# Altium project AP1220_Control.PrjPcb
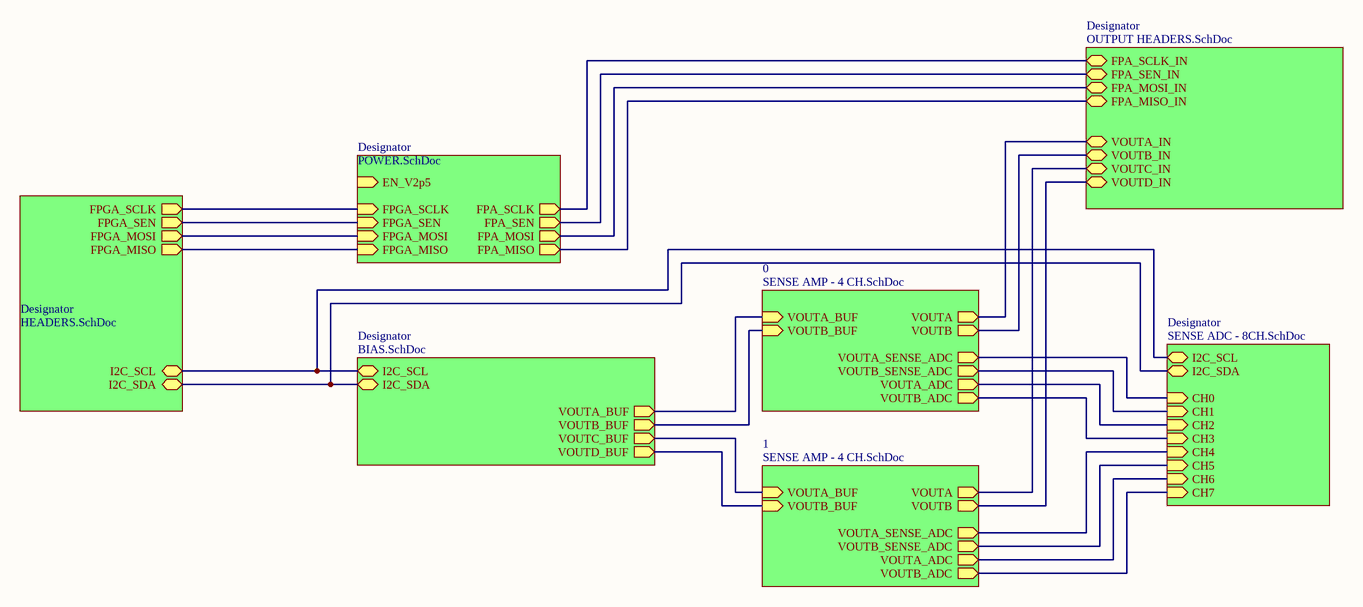
[diagram p0: AP1220_CONTROL.SchDoc]
7 sheets, 120 parts. Net scope: hierarchical (ports join the sheet entries above them; power ports are global).
Board file: AP1220_MachXO2_DB.PcbDoc
Sheets:
  AP1220_CONTROL.SchDoc
    Designator = HEADERS.SchDoc
    Designator = BIAS.SchDoc
    Designator = POWER.SchDoc
    0 = SENSE AMP - 4 CH.SchDoc
    1 = SENSE AMP - 4 CH.SchDoc
    Designator = SENSE ADC - 8CH.SchDoc
    Designator = OUTPUT HEADERS.SchDoc

## Sheet AP1220_CONTROL.SchDoc
size B; Organization: Altium Limited; Address1: L3, 12a Rodborough Rd; Address2: Frenchs Forest; Address3: NSW; Address4: Australia 2086

### Sub-sheets
0 = SENSE AMP - 4 CH.SchDoc: VOUTA_BUF (in), VOUTB_BUF (in), VOUTA (out), VOUTB (out), VOUTA_SENSE_ADC (out), VOUTB_SENSE_ADC (out), VOUTA_ADC (out), VOUTB_ADC (out)
1 = SENSE AMP - 4 CH.SchDoc: VOUTA_BUF (in), VOUTB_BUF (in), VOUTA (out), VOUTB (out), VOUTA_SENSE_ADC (out), VOUTB_SENSE_ADC (out), VOUTA_ADC (out), VOUTB_ADC (out)
Designator = HEADERS.SchDoc: I2C_SCL (bidir), I2C_SDA (bidir), FPGA_SEN (out), FPGA_MOSI (out), FPGA_MISO (out), FPGA_SCLK (out)
Designator = BIAS.SchDoc: I2C_SCL (bidir), I2C_SDA (bidir), VOUTA_BUF (out), VOUTD_BUF (out), VOUTB_BUF (out), VOUTC_BUF (out)
Designator = POWER.SchDoc: EN_V2p5 (in), FPGA_SEN (in), FPGA_MOSI (in), FPGA_MISO (in), FPGA_SCLK (in), FPA_SCLK (out), FPA_SEN (out), FPA_MOSI (out), FPA_MISO (out)
Designator = SENSE ADC - 8CH.SchDoc: I2C_SCL (bidir), I2C_SDA (bidir), CH0 (in), CH1 (in), CH2 (in), CH3 (in), CH4 (in), CH5 (in), CH6 (in), CH7 (in)
Designator = OUTPUT HEADERS.SchDoc: VOUTA_IN, VOUTB_IN, VOUTC_IN, VOUTD_IN, FPA_SCLK_IN, FPA_SEN_IN, FPA_MOSI_IN, FPA_MISO_IN

### Nets
VoutA: sheet 0/VOUTA, sheet Designator/VOUTA_IN
VoutA: sheet 1/VOUTA, sheet Designator/VOUTC_IN  [a separate net that carries the same name]
VoutB: sheet 0/VOUTB, sheet Designator/VOUTB_IN
VoutB: sheet 1/VOUTB, sheet Designator/VOUTD_IN  [a separate net that carries the same name]
NetC23_0_2: sheet 0/VOUTA_SENSE_ADC, sheet Designator/CH0
NetC23_1_2: sheet 1/VOUTA_SENSE_ADC, sheet Designator/CH4
NetC24_0_2: sheet 0/VOUTB_SENSE_ADC, sheet Designator/CH1
NetC24_1_2: sheet 1/VOUTB_SENSE_ADC, sheet Designator/CH5
NetC25_0_2: sheet 0/VOUTA_ADC, sheet Designator/CH2
NetC25_1_2: sheet 1/VOUTA_ADC, sheet Designator/CH6
NetC26_0_2: sheet 0/VOUTB_ADC, sheet Designator/CH3
NetC26_1_2: sheet 1/VOUTB_ADC, sheet Designator/CH7
NetJ1_2: sheet Designator/FPA_SCLK, sheet Designator/FPA_SCLK_IN
NetJ1_4: sheet Designator/FPA_SEN, sheet Designator/FPA_SEN_IN
NetJ1_6: sheet Designator/FPA_MOSI, sheet Designator/FPA_MOSI_IN
NetJ1_8: sheet Designator/FPA_MISO, sheet Designator/FPA_MISO_IN
NetJ4B_6: sheet Designator/I2C_SCL, sheet Designator/I2C_SCL, sheet Designator/I2C_SCL
NetJ4B_8: sheet Designator/I2C_SDA, sheet Designator/I2C_SDA, sheet Designator/I2C_SDA
NetJ4B_10: sheet Designator/FPGA_SCLK, sheet Designator/FPGA_SCLK
NetJ4B_12: sheet Designator/FPGA_SEN, sheet Designator/FPGA_SEN
NetJ4B_16: sheet Designator/FPGA_MOSI, sheet Designator/FPGA_MOSI
NetJ4B_18: sheet Designator/FPGA_MISO, sheet Designator/FPGA_MISO
NetR13_2: sheet Designator/VOUTA_BUF, sheet 0/VOUTA_BUF
NetR14_1: sheet Designator/VOUTD_BUF, sheet 1/VOUTB_BUF
NetR18_1_2: sheet Designator/VOUTC_BUF, sheet 1/VOUTA_BUF
NetR20_0_2: sheet Designator/VOUTB_BUF, sheet 0/VOUTB_BUF

### Notes on the sheet
- Title
- Size:
- Date:
- B
- Number:
- Time:
- Revision:
- Sheet
- of
- File:

## Sheet HEADERS.SchDoc
size B; Organization: Altium Limited; Address1: L3, 12a Rodborough Rd; Address2: Frenchs Forest; Address3: NSW; Address4: Australia 2086
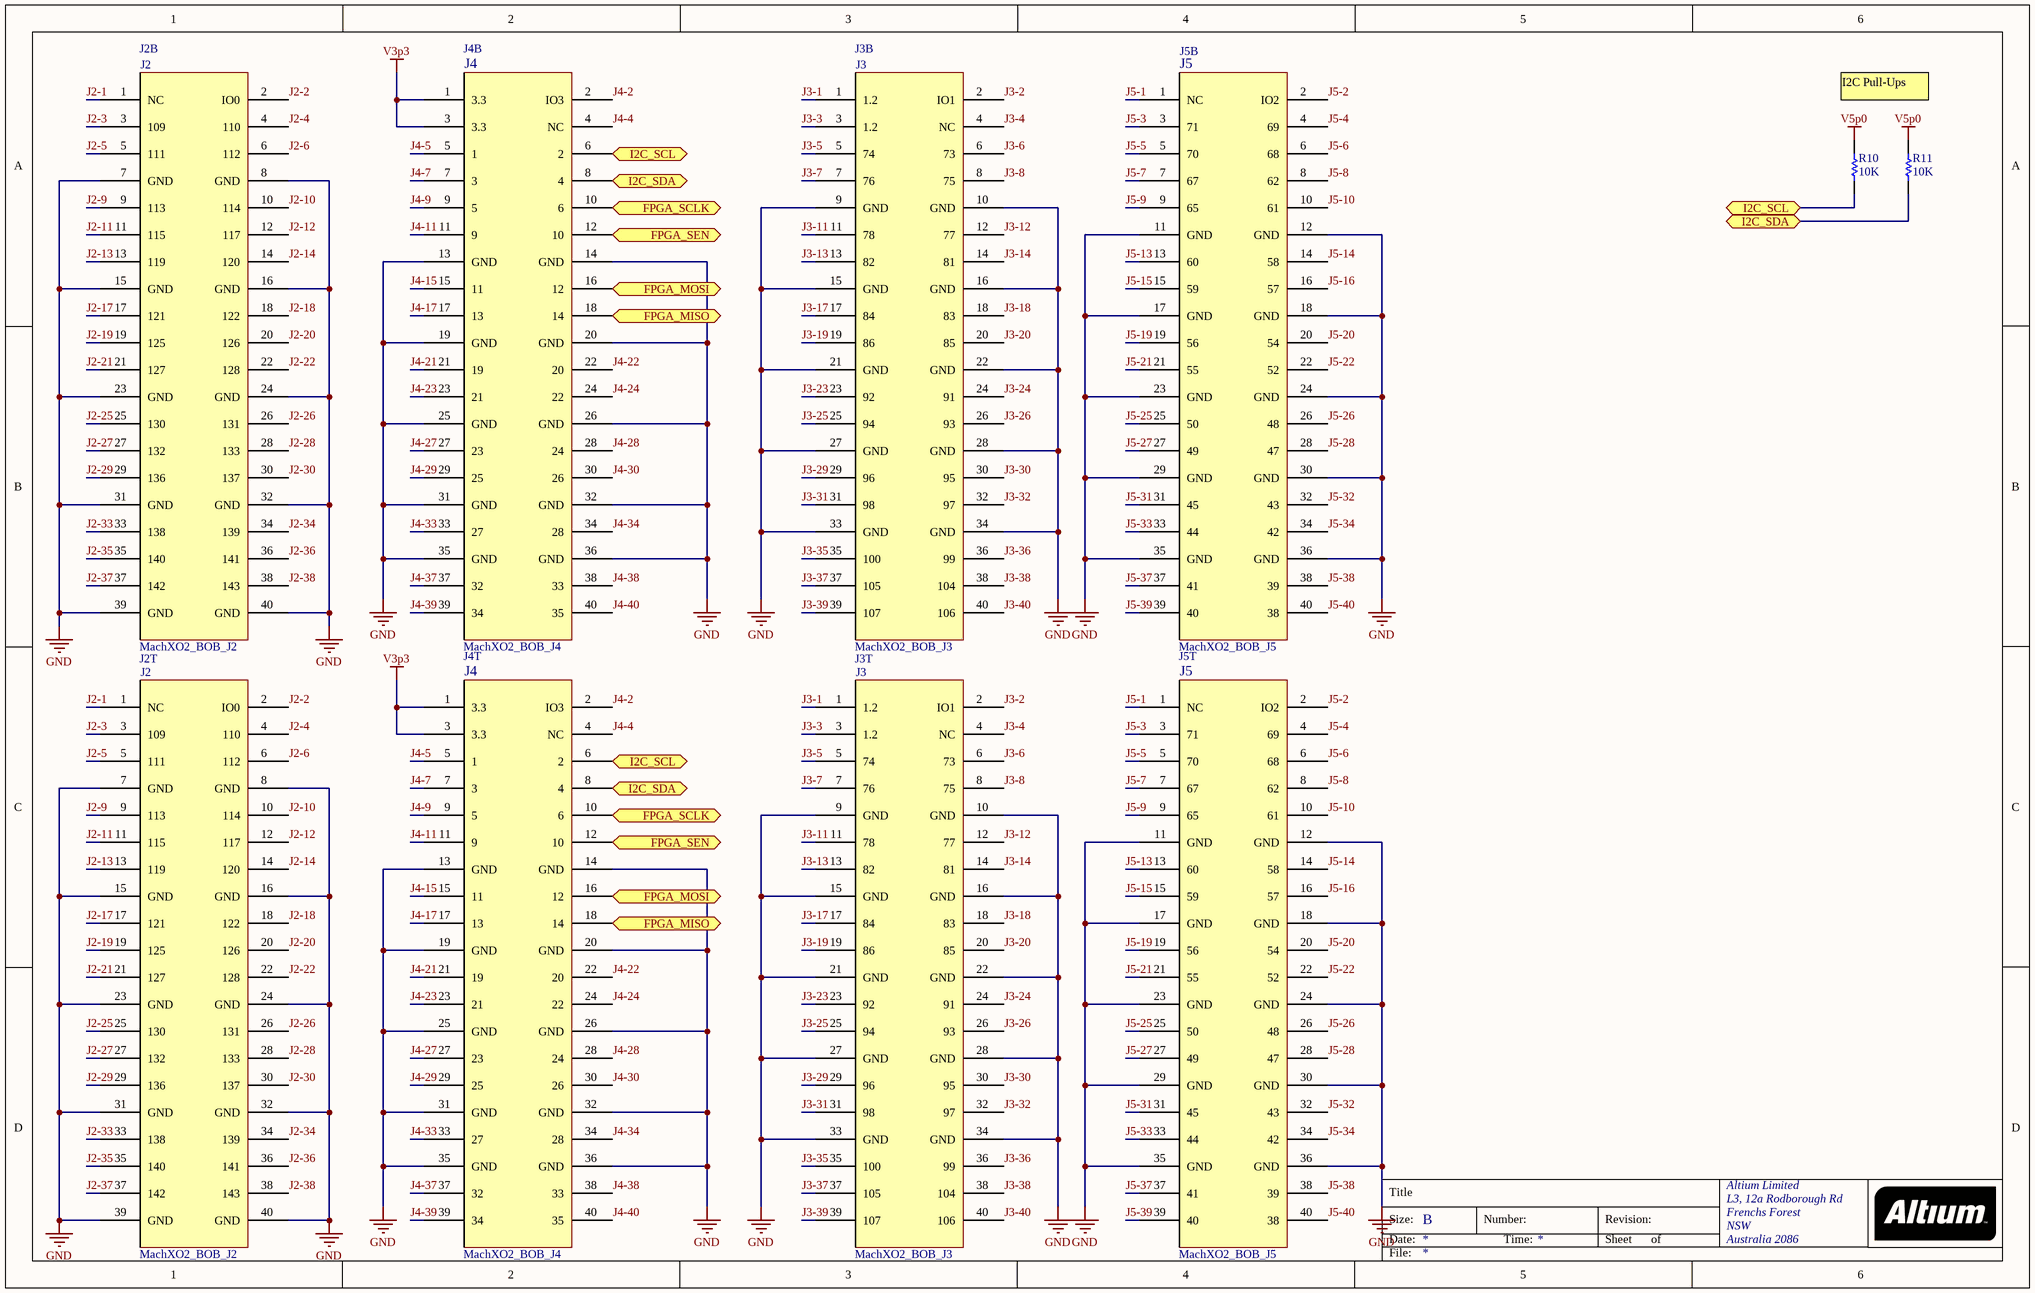
[diagram p1: HEADERS.SchDoc]

### Parts
J2B  MachXO2_BOB_J2  [RECEPTACLE_25.4MM_20x2_P1URC_SMT - duplicate]
J2T  MachXO2_BOB_J2  [HEADER_25.4MM_20x2_SMT_TOP]
J3B  MachXO2_BOB_J3  [RECEPTACLE_25.4MM_20x2_P1URC_SMT - duplicate]
J3T  MachXO2_BOB_J3  [HEADER_25.4MM_20x2_SMT_TOP]
J4B  MachXO2_BOB_J4  [RECEPTACLE_25.4MM_20x2_P1URC_SMT - duplicate]
J4T  MachXO2_BOB_J4  [HEADER_25.4MM_20x2_SMT_TOP]
J5B  MachXO2_BOB_J5  [RECEPTACLE_25.4MM_20x2_P1URC_SMT - duplicate]
J5T  MachXO2_BOB_J5  [HEADER_25.4MM_20x2_SMT_TOP]
R10  10K  [RES, 0603]
R11  10K  [RES, 0603]

### Ports
FPGA_MISO (bidir), FPGA_MOSI, FPGA_SCLK (bidir), FPGA_SEN (bidir), I2C_SCL (bidir), I2C_SDA (bidir)

### Nets
GND: J2B.7(GND) J2B.8(GND) J2B.15(GND) J2B.16(GND) J2B.23(GND) J2B.24(GND) J2B.31(GND) J2B.32(GND) J2B.39(GND) J2B.40(GND) J2T.7(GND) J2T.8(GND) J2T.15(GND) J2T.16(GND) J2T.23(GND) J2T.24(GND) J2T.31(GND) J2T.32(GND) J2T.39(GND) J2T.40(GND) J3B.9(GND) J3B.10(GND) J3B.15(GND) J3B.16(GND) J3B.21(GND) J3B.22(GND) J3B.27(GND) J3B.28(GND) J3B.33(GND) J3B.34(GND) J3T.9(GND) J3T.10(GND) J3T.15(GND) J3T.16(GND) J3T.21(GND) J3T.22(GND) J3T.27(GND) J3T.28(GND) J3T.33(GND) J3T.34(GND) J4B.13(GND) J4B.14(GND) J4B.19(GND) J4B.20(GND) J4B.25(GND) J4B.26(GND) J4B.31(GND) J4B.32(GND) J4B.35(GND) J4B.36(GND) J4T.13(GND) J4T.14(GND) J4T.19(GND) J4T.20(GND) J4T.25(GND) J4T.26(GND) J4T.31(GND) J4T.32(GND) J4T.35(GND) J4T.36(GND) J5B.11(GND) J5B.12(GND) J5B.17(GND) J5B.18(GND) J5B.23(GND) J5B.24(GND) J5B.29(GND) J5B.30(GND) J5B.35(GND) J5B.36(GND) J5T.11(GND) J5T.12(GND) J5T.17(GND) J5T.18(GND) J5T.23(GND) J5T.24(GND) J5T.29(GND) J5T.30(GND) J5T.35(GND) J5T.36(GND)
V3p3: J4B.1(3.3) J4B.3(3.3) J4T.1(3.3) J4T.3(3.3)
V5p0: R10.1 R11.1
J2-1: J2B.1(NC) J2T.1(NC)
J2-2: J2B.2(IO0) J2T.2(IO0)
J2-3: J2B.3(109) J2T.3(109)
J2-4: J2B.4(110) J2T.4(110)
J2-5: J2B.5(111) J2T.5(111)
J2-6: J2B.6(112) J2T.6(112)
J2-9: J2B.9(113) J2T.9(113)
J2-10: J2B.10(114) J2T.10(114)
J2-11: J2B.11(115) J2T.11(115)
J2-12: J2B.12(117) J2T.12(117)
J2-13: J2B.13(119) J2T.13(119)
J2-14: J2B.14(120) J2T.14(120)
J2-17: J2B.17(121) J2T.17(121)
J2-18: J2B.18(122) J2T.18(122)
J2-19: J2B.19(125) J2T.19(125)
J2-20: J2B.20(126) J2T.20(126)
J2-21: J2B.21(127) J2T.21(127)
J2-22: J2B.22(128) J2T.22(128)
J2-25: J2B.25(130) J2T.25(130)
J2-26: J2B.26(131) J2T.26(131)
J2-27: J2B.27(132) J2T.27(132)
J2-28: J2B.28(133) J2T.28(133)
J2-29: J2B.29(136) J2T.29(136)
J2-30: J2B.30(137) J2T.30(137)
J2-33: J2B.33(138) J2T.33(138)
J2-34: J2B.34(139) J2T.34(139)
J2-35: J2B.35(140) J2T.35(140)
J2-36: J2B.36(141) J2T.36(141)
J2-37: J2B.37(142) J2T.37(142)
J2-38: J2B.38(143) J2T.38(143)
J3-1: J3B.1(1.2) J3T.1(1.2)
J3-2: J3B.2(IO1) J3T.2(IO1)
J3-3: J3B.3(1.2) J3T.3(1.2)
J3-4: J3B.4(NC) J3T.4(NC)
J3-5: J3B.5(74) J3T.5(74)
J3-6: J3B.6(73) J3T.6(73)
J3-7: J3B.7(76) J3T.7(76)
J3-8: J3B.8(75) J3T.8(75)
J3-11: J3B.11(78) J3T.11(78)
J3-12: J3B.12(77) J3T.12(77)
J3-13: J3B.13(82) J3T.13(82)
J3-14: J3B.14(81) J3T.14(81)
J3-17: J3B.17(84) J3T.17(84)
J3-18: J3B.18(83) J3T.18(83)
J3-19: J3B.19(86) J3T.19(86)
J3-20: J3B.20(85) J3T.20(85)
J3-23: J3B.23(92) J3T.23(92)
J3-24: J3B.24(91) J3T.24(91)
J3-25: J3B.25(94) J3T.25(94)
J3-26: J3B.26(93) J3T.26(93)
J3-29: J3B.29(96) J3T.29(96)
J3-30: J3B.30(95) J3T.30(95)
J3-31: J3B.31(98) J3T.31(98)
J3-32: J3B.32(97) J3T.32(97)
J3-35: J3B.35(100) J3T.35(100)
J3-36: J3B.36(99) J3T.36(99)
J3-37: J3B.37(105) J3T.37(105)
J3-38: J3B.38(104) J3T.38(104)
J3-39: J3B.39(107) J3T.39(107)
J3-40: J3B.40(106) J3T.40(106)
J4-2: J4B.2(IO3) J4T.2(IO3)
J4-4: J4B.4(NC) J4T.4(NC)
J4-5: J4B.5(1) J4T.5(1)
J4-7: J4B.7(3) J4T.7(3)
J4-9: J4B.9(5) J4T.9(5)
J4-11: J4B.11(9) J4T.11(9)
J4-15: J4B.15(11) J4T.15(11)
J4-17: J4B.17(13) J4T.17(13)
J4-21: J4B.21(19) J4T.21(19)
J4-22: J4B.22(20) J4T.22(20)
J4-23: J4B.23(21) J4T.23(21)
J4-24: J4B.24(22) J4T.24(22)
J4-27: J4B.27(23) J4T.27(23)
J4-28: J4B.28(24) J4T.28(24)
J4-29: J4B.29(25) J4T.29(25)
J4-30: J4B.30(26) J4T.30(26)
J4-33: J4B.33(27) J4T.33(27)
J4-34: J4B.34(28) J4T.34(28)
J4-37: J4B.37(32) J4T.37(32)
J4-38: J4B.38(33) J4T.38(33)
J4-39: J4B.39(34) J4T.39(34)
J4-40: J4B.40(35) J4T.40(35)
J5-1: J5B.1(NC) J5T.1(NC)
J5-2: J5B.2(IO2) J5T.2(IO2)
J5-3: J5B.3(71) J5T.3(71)
J5-4: J5B.4(69) J5T.4(69)
J5-5: J5B.5(70) J5T.5(70)
J5-6: J5B.6(68) J5T.6(68)
J5-7: J5B.7(67) J5T.7(67)
J5-8: J5B.8(62) J5T.8(62)
J5-9: J5B.9(65) J5T.9(65)
J5-10: J5B.10(61) J5T.10(61)
J5-13: J5B.13(60) J5T.13(60)
J5-14: J5B.14(58) J5T.14(58)
J5-15: J5B.15(59) J5T.15(59)
J5-16: J5B.16(57) J5T.16(57)
J5-19: J5B.19(56) J5T.19(56)
J5-20: J5B.20(54) J5T.20(54)
J5-21: J5B.21(55) J5T.21(55)
J5-22: J5B.22(52) J5T.22(52)
J5-25: J5B.25(50) J5T.25(50)
J5-26: J5B.26(48) J5T.26(48)
J5-27: J5B.27(49) J5T.27(49)
J5-28: J5B.28(47) J5T.28(47)
J5-31: J5B.31(45) J5T.31(45)
J5-32: J5B.32(43) J5T.32(43)
J5-33: J5B.33(44) J5T.33(44)
J5-34: J5B.34(42) J5T.34(42)
J5-37: J5B.37(41) J5T.37(41)
J5-38: J5B.38(39) J5T.38(39)
J5-39: J5B.39(40) J5T.39(40)
J5-40: J5B.40(38) J5T.40(38)
NetJ4B_6: J4B.6(2) J4T.6(2) R10.2 ; port I2C_SCL
NetJ4B_8: J4B.8(4) J4T.8(4) R11.2 ; port I2C_SDA
NetJ4B_10: J4B.10(6) J4T.10(6) ; port FPGA_SCLK
NetJ4B_12: J4B.12(10) J4T.12(10) ; port FPGA_SEN
NetJ4B_16: J4B.16(12) J4T.16(12) ; port FPGA_MOSI
NetJ4B_18: J4B.18(14) J4T.18(14) ; port FPGA_MISO

### Notes on the sheet
- I2C Pull-Ups
- Title
- Size:
- Date:
- B
- Number:
- Time:
- Revision:
- Sheet
- of
- File:
- (in symbol MachXO2_BOB_J2) J2
- (in symbol MachXO2_BOB_J3) J3
- (in symbol MachXO2_BOB_J4) J4
- (in symbol MachXO2_BOB_J5) J5

### Library data of the parts
J2B J2T = MachXO2_BOB_J2: Manufacturer: 3M; Manufacturer Part Number: 966240-2000-AR-PR; Connector Type: Receptacle, Pass Through; Number of Positions: 40; Number of Positions Loaded: All; Pitch: 0.100" (2.54mm); Description: CONN SOCKET LO-PRO 40PS GOLD SMD; Packaging: Cut Tape (CT); Contact Type: Female Socket; Number of Rows: 2; Row Spacing: 0.100" (2.54mm); Mounting Type: Surface Mount; Termination: Solder; Fastening Type: -; Features: -; Contact Finish: Gold; Contact Finish Thickness: Flash; Color: Black; ComponentLink1URL: http://multimedia.3m.com/mws/mediawebserver?66666UuZjcFSLXTtNxTElXftEVuQEcuZgVs6EVs6E666666--; ComponentLink1Description: http://multimedia.3m.com/mws/mediawebserver?66666UuZjcFSLXTtNxTElXftEVuQEcuZgVs6EVs6E666666--; Supplier 1: Digi-Key; Supplier Part Number 1: 3M9579CT-ND; RoHS: RoHS Compliant; Category: Connectors, Interconnects; Stock 1: 767; Pricing 1: 1=6.97, 10=6.679, 25=6.0984, 50=5.808, 100=5.5176, 250=4.9368 (USD); Supplier 2: Digi-Key; Supplier Part Number 2: TSM-120-01-L-DV-P-ND
J3B J3T = MachXO2_BOB_J3: Manufacturer: 3M; Manufacturer Part Number: 966240-2000-AR-PR; Connector Type: Receptacle, Pass Through; Number of Positions: 40; Number of Positions Loaded: All; Pitch: 0.100" (2.54mm); Description: CONN SOCKET LO-PRO 40PS GOLD SMD; Packaging: Cut Tape (CT); Contact Type: Female Socket; Number of Rows: 2; Row Spacing: 0.100" (2.54mm); Mounting Type: Surface Mount; Termination: Solder; Fastening Type: -; Features: -; Contact Finish: Gold; Contact Finish Thickness: Flash; Color: Black; ComponentLink1URL: http://multimedia.3m.com/mws/mediawebserver?66666UuZjcFSLXTtNxTElXftEVuQEcuZgVs6EVs6E666666--; ComponentLink1Description: http://multimedia.3m.com/mws/mediawebserver?66666UuZjcFSLXTtNxTElXftEVuQEcuZgVs6EVs6E666666--; Supplier 1: Digi-Key; Supplier Part Number 1: 3M9579CT-ND; RoHS: RoHS Compliant; Category: Connectors, Interconnects; Stock 1: 767; Pricing 1: 1=6.97, 10=6.679, 25=6.0984, 50=5.808, 100=5.5176, 250=4.9368 (USD)
J4B J4T = MachXO2_BOB_J4: Manufacturer: 3M; Manufacturer Part Number: 966240-2000-AR-PR; Connector Type: Receptacle, Pass Through; Number of Positions: 40; Number of Positions Loaded: All; Pitch: 0.100" (2.54mm); Description: CONN SOCKET LO-PRO 40PS GOLD SMD; Packaging: Cut Tape (CT); Contact Type: Female Socket; Number of Rows: 2; Row Spacing: 0.100" (2.54mm); Mounting Type: Surface Mount; Termination: Solder; Fastening Type: -; Features: -; Contact Finish: Gold; Contact Finish Thickness: Flash; Color: Black; ComponentLink1URL: http://multimedia.3m.com/mws/mediawebserver?66666UuZjcFSLXTtNxTElXftEVuQEcuZgVs6EVs6E666666--; ComponentLink1Description: http://multimedia.3m.com/mws/mediawebserver?66666UuZjcFSLXTtNxTElXftEVuQEcuZgVs6EVs6E666666--; Supplier 1: Digi-Key; Supplier Part Number 1: 3M9579CT-ND; RoHS: RoHS Compliant; Category: Connectors, Interconnects; Stock 1: 767; Pricing 1: 1=6.97, 10=6.679, 25=6.0984, 50=5.808, 100=5.5176, 250=4.9368 (USD)
J5B J5T = MachXO2_BOB_J5: Manufacturer: 3M; Manufacturer Part Number: 966240-2000-AR-PR; Connector Type: Receptacle, Pass Through; Number of Positions: 40; Number of Positions Loaded: All; Pitch: 0.100" (2.54mm); Description: CONN SOCKET LO-PRO 40PS GOLD SMD; Packaging: Cut Tape (CT); Contact Type: Female Socket; Number of Rows: 2; Row Spacing: 0.100" (2.54mm); Mounting Type: Surface Mount; Termination: Solder; Fastening Type: -; Features: -; Contact Finish: Gold; Contact Finish Thickness: Flash; Color: Black; ComponentLink1URL: http://multimedia.3m.com/mws/mediawebserver?66666UuZjcFSLXTtNxTElXftEVuQEcuZgVs6EVs6E666666--; ComponentLink1Description: http://multimedia.3m.com/mws/mediawebserver?66666UuZjcFSLXTtNxTElXftEVuQEcuZgVs6EVs6E666666--; Supplier 1: Digi-Key; Supplier Part Number 1: 3M9579CT-ND; RoHS: RoHS Compliant; Category: Connectors, Interconnects; Stock 1: 767; Pricing 1: 1=6.97, 10=6.679, 25=6.0984, 50=5.808, 100=5.5176, 250=4.9368 (USD)
R10 R11 = RES_0603_10K: Resistor, 0603, 1/10W, 10K ohm; Manufacturer: Panasonic Electronic Components; Manufacturer Part Number: ERJ-3EKF1002V; Description: RES 10K OHM 1/10W 1% 0603 SMD; Tolerance: ±1%; Power (Watts): 0.1W, 1/10W; Temperature Coefficient: ±100ppm/°C; Supplier 1: Digi-Key; RoHS: RoHS Compliant; Category: Resistors; Stock 1: 4631019; Pricing 1: 1=0.1, 50=0.0138, 100=0.0105, 250=0.0078, 500=0.00576, 1000=0.00384 (USD); Packaging: Cut Tape (CT); Resistance (Ohms): 10k; Composition: Thick Film; Features: -; Package / Case: 0603 (1608 Metric); Supplier Device Package: 0603; Size / Dimension: 0.063" L x 0.031" W (1.60mm x 0.80mm); Height: 0.022" (0.55mm); Number of Terminations: 2; ComponentLink1URL: http://industrial.panasonic.com/www-cgi/jvcr13pz.cgi?E+PZ+3+AOA0002+ERJ3EKF1002V+7+WW; ComponentLink1Description: http://industrial.panasonic.com/www-cgi/jvcr13pz.cgi?E+PZ+3+AOA0002+ERJ3EKF1002V+7+WW; Supplier Part Number 1: P10.0KHCT-ND

## Sheet BIAS.SchDoc
size B; Organization: Altium Limited; Address1: L3, 12a Rodborough Rd; Address2: Frenchs Forest; Address3: NSW; Address4: Australia 2086
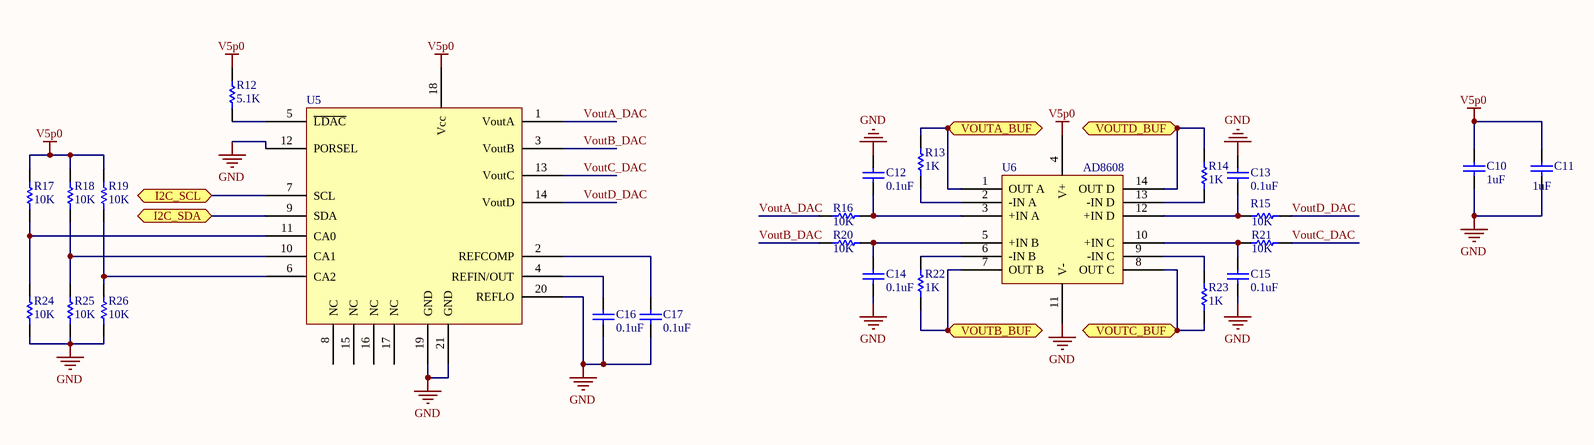
[diagram p2: BIAS.SchDoc]

### Parts
C10  value 1uF  [CAPC01005(0402)22_N]  (hidden comment: CAP, 0402, 1uF)
C11  value 1uF  [CAPC01005(0402)22_N]  (hidden comment: CAP, 0402, 1uF)
C12  value 0.1uF  [CAPC01005(0402)22_N]  (hidden comment: CAP, 0402, 0.1uF)
C13  value 0.1uF  [CAPC01005(0402)22_N]  (hidden comment: CAP, 0402, 0.1uF)
C14  value 0.1uF  [CAPC01005(0402)22_N]  (hidden comment: CAP, 0402, 0.1uF)
C15  value 0.1uF  [CAPC01005(0402)22_N]  (hidden comment: CAP, 0402, 0.1uF)
C16  value 0.1uF  [CAPC01005(0402)22_N]  (hidden comment: CAP, 0402, 0.1uF)
C17  value 0.1uF  [CAPC01005(0402)22_N]  (hidden comment: CAP, 0402, 0.1uF)
R12  5.1K  [RES, 0603]
R13  1K  [RES, 0603]
R14  1K  [RES, 0603]
R15  10K  [RES, 0603]
R16  10K  [RES, 0603]
R17  10K  [RES, 0603]
R18  10K  [RES, 0603]
R19  10K  [RES, 0603]
R20  10K  [RES, 0603]
R21  10K  [RES, 0603]
R22  1K  [RES, 0603]
R23  1K  [RES, 0603]
R24  10K  [RES, 0603]
R25  10K  [RES, 0603]
R26  10K  [RES, 0603]
U5  LTC2655  [QFN50P400X400X70-20N]  (value not drawn)
U6  AD8608  [TSOP65P640X120-14N]

### Ports
I2C_SCL (bidir), I2C_SDA (bidir), VOUTA_BUF (out), VOUTB_BUF (out), VOUTC_BUF (out), VOUTD_BUF (out)

### Nets
GND: C10.1 C11.1 C12.2 C13.1 C14.1 C15.2 C16.1 C17.1 R24.2 R25.2 R26.2 U5.12(PORSEL) U5.19(GND) U5.20(REFLO) U5.21(GND) U6.11(V-)
V5p0: C10.2 C11.2 R12.2 R17.1 R18.1 R19.1 U5.18(Vcc) U6.4(V+)
VoutA_DAC: R16.1 U5.1(VoutA)
VoutB_DAC: R20.1 U5.3(VoutB)
VoutC_DAC: R21.1 U5.13(VoutC)
VoutD_DAC: R15.1 U5.14(VoutD)
NetC12_1: C12.1 R16.2 U6.3(+IN_A)
NetC13_2: C13.2 R15.2 U6.12(+IN_D)
NetC14_2: C14.2 R20.2 U6.5(+IN_B)
NetC15_1: C15.1 R21.2 U6.10(+IN_C)
NetC16_2: C16.2 U5.4(REFIN/OUT)
NetC17_2: C17.2 U5.2(REFCOMP)
NetJ4B_6: U5.7(SCL) ; port I2C_SCL
NetJ4B_8: U5.9(SDA) ; port I2C_SDA
NetR12_1: R12.1 U5.5(~{LDAC})
NetR13_1: R13.1 U6.2(-IN_A)
NetR13_2: R13.2 U6.1(OUT_A) ; port VOUTA_BUF
NetR14_1: R14.1 U6.14(OUT_D) ; port VOUTD_BUF
NetR14_2: R14.2 U6.13(-IN_D)
NetR17_2: R17.2 R24.1 U5.11(CA0)
NetR18_1_2: R23.2 U6.8(OUT_C) ; port VOUTC_BUF
NetR18_2: R18.2 R25.1 U5.10(CA1)
NetR19_2: R19.2 R26.1 U5.6(CA2)
NetR20_0_2: R22.1 U6.7(OUT_B) ; port VOUTB_BUF
NetR22_2: R22.2 U6.6(-IN_B)
NetR23_1: R23.1 U6.9(-IN_C)

Not connected (* = marked no-connect by the designer): U5 8(NC) 15(NC) 16(NC) 17(NC)

### Notes on the sheet
- Title
- Size:
- Date:
- B
- Number:
- Time:
- Revision:
- Sheet
- of
- File:

### Library data of the parts
R12 = RES_0603_5.1K: Resistor, 0603, 1/10W, 5.1K ohm; Manufacturer: Panasonic Electronic Components; Manufacturer Part Number: ERJ-3EKF5101V; Description: RES 5.1K OHM 1/10W 1% 0603 SMD; Tolerance: ±1%; Power (Watts): 0.1W, 1/10W; Temperature Coefficient: ±100ppm/°C; Supplier 1: Digi-Key; RoHS: RoHS Compliant; Category: Resistors; Stock 1: 63967; Pricing 1: 1=0.1, 50=0.0138, 100=0.0105, 250=0.0078, 500=0.00576, 1000=0.00384 (USD); Packaging: Cut Tape (CT); Resistance (Ohms): 5.1k; Composition: Thick Film; Features: -; Package / Case: 0603 (1608 Metric); Supplier Device Package: 0603; Size / Dimension: 0.063" L x 0.031" W (1.60mm x 0.80mm); Height: 0.022" (0.55mm); Number of Terminations: 2; ComponentLink1URL: http://industrial.panasonic.com/www-cgi/jvcr13pz.cgi?E+PZ+3+AOA0002+ERJ3EKF5101V+7+WW; ComponentLink1Description: http://industrial.panasonic.com/www-cgi/jvcr13pz.cgi?E+PZ+3+AOA0002+ERJ3EKF5101V+7+WW; Supplier Part Number 1: P5.10KHCT-ND
R13 R14 R22 R23 = RES_0603_1K: Resistor, 0603, 1/10W, 1K ohm; Manufacturer: Panasonic Electronic Components; Manufacturer Part Number: ERJ-3EKF1001V; Description: RES 1K OHM 1/10W 1% 0603 SMD; Tolerance: ±1%; Power (Watts): 0.1W, 1/10W; Temperature Coefficient: ±100ppm/°C; Supplier 1: Digi-Key; RoHS: RoHS Compliant; Category: Resistors; Stock 1: 3447685; Pricing 1: 1=0.1, 50=0.0138, 100=0.0105, 250=0.0078, 500=0.00576, 1000=0.00384 (USD); Packaging: Cut Tape (CT); Resistance (Ohms): 1k; Composition: Thick Film; Features: -; Package / Case: 0603 (1608 Metric); Supplier Device Package: 0603; Size / Dimension: 0.063" L x 0.031" W (1.60mm x 0.80mm); Height: 0.022" (0.55mm); Number of Terminations: 2; ComponentLink1URL: http://industrial.panasonic.com/www-cgi/jvcr13pz.cgi?E+PZ+3+AOA0002+ERJ3EKF1001V+7+WW; ComponentLink1Description: http://industrial.panasonic.com/www-cgi/jvcr13pz.cgi?E+PZ+3+AOA0002+ERJ3EKF1001V+7+WW; Supplier Part Number 1: P1.00KHCT-ND
R15-R21 R24-R26 = RES_0603_10K: as R10 on sheet HEADERS; Supplier 1: Digi-Key; RoHS: RoHS Compliant; Category: Resistors; Stock 1: 4631019; Pricing 1: 1=0.1, 50=0.0138, 100=0.0105, 250=0.0078, 500=0.00576, 1000=0.00384 (USD); Packaging: Cut Tape (CT); Resistance (Ohms): 10k; Composition: Thick Film; Features: -; Package / Case: 0603 (1608 Metric); Supplier Device Package: 0603; Size / Dimension: 0.063" L x 0.031" W (1.60mm x 0.80mm); Height: 0.022" (0.55mm); Number of Terminations: 2; ComponentLink1URL: http://industrial.panasonic.com/www-cgi/jvcr13pz.cgi?E+PZ+3+AOA0002+ERJ3EKF1002V+7+WW; ComponentLink1Description: http://industrial.panasonic.com/www-cgi/jvcr13pz.cgi?E+PZ+3+AOA0002+ERJ3EKF1002V+7+WW; Supplier Part Number 1: P10.0KHCT-ND
U5 = LTC2655: Quad I2C 16-/12-Bit Rail-to-Rail DACs with 10ppm/°C Max Reference; Supplier 1: Digi-Key; Supplier Part Number 1: LTC2655BIUF-L16#PBF-ND
U6 = AD8608; Quad Op-Amp: Manufacturer: Analog Devices Inc; Manufacturer Part Number: AD8608ARZ-REEL; Amplifier Type: General Purpose; Number of Circuits: 4; Output Type: Rail-to-Rail; Slew Rate: 5 V/µs; Gain Bandwidth Product: 10MHz; Current - Input Bias: 0.2pA; Voltage - Input Offset: 80µV; Current - Supply: 1mA; Current - Output / Channel: 80mA; Voltage - Supply, Single/Dual (±): 2.7 V ~ 5.5 V; Description: IC OPAMP GP 10MHZ RRO 14SOIC; Packaging: Cut Tape (CT); -3db Bandwidth: -; Operating Temperature: -40°C ~ 125°C; Mounting Type: Surface Mount; Package / Case: 14-SOIC (0.154", 3.90mm Width); Supplier Device Package: 14-SOIC; ComponentLink1URL: http://www.analog.com/static/imported-files/data_sheets/AD8605_8606_8608.pdf; ComponentLink1Description: http://www.analog.com/static/imported-files/data_sheets/AD8605_8606_8608.pdf; Supplier 1: Digi-Key; Supplier Part Number 1: AD8608ARZ-REELCT-ND; RoHS: RoHS Compliant; Stock 1: 2419; Pricing 1: 1=4.22, 10=3.785, 25=3.4036, 100=3.0954, 250=2.80196, 500=2.50858, 1000=2.11248 (USD); Category: Integrated Circuits (ICs)
C10 C11 = CAP, 0402, 1uF: Supplier 1: Digi-Key; Supplier Part Number 1: 587-3245-1-ND
C12-C17 = CAP, 0402, 0.1uF: Supplier 1: Digi-Key; Supplier Part Number 1: 587-1456-2-ND

## Sheet POWER.SchDoc
size B; Organization: Altium Limited; Address1: L3, 12a Rodborough Rd; Address2: Frenchs Forest; Address3: NSW; Address4: Australia 2086
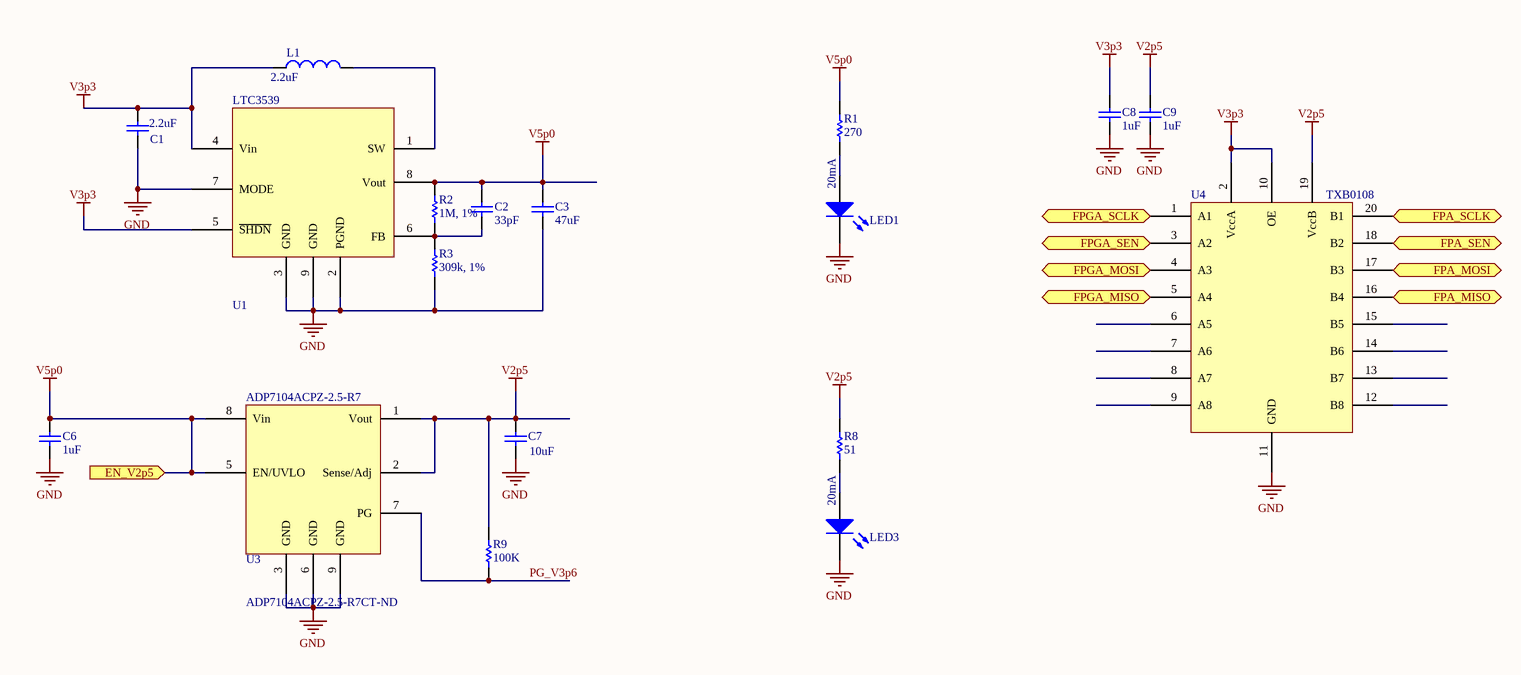
[diagram p3: POWER.SchDoc]

### Parts
C1  value 2.2uF  [CAPC1206(3216)170_N]  (hidden comment: 587-1329-2-ND)
C2  value 33pF  [CAPC01005(0402)22_N]  (hidden comment: CAP, 0402, 33pF)
C3  value 47uF  [CAPC1206(3216)170_N]  (hidden comment: CAP, 1206, 47uF)
C6  value 1uF  [CAPC01005(0402)22_N]  (hidden comment: CAP, 0402, 1uF)
C7  value 10uF  [CAPC0805(2012)130_N]  (hidden comment: CAP, 0805, 10uF)
C8  value 1uF  [CAPC01005(0402)22_N]  (hidden comment: CAP, 0402, 1uF)
C9  value 1uF  [CAPC01005(0402)22_N]  (hidden comment: CAP, 0402, 1uF)
L1  value 2.2uF  [INDUCTOR, SMD, TDK]  (hidden comment: INDUCTOR, SMD, 2.2uF)
LED1  LED, GREEN, 0603, LITE-ON  [0603, LED]  (value not drawn)
LED3  LED, GREEN, 0603, LITE-ON  [0603, LED]  (value not drawn)
R1  270  [RES, 0603]
R2  value 1M, 1%  [RESC0402(1005)_N]  (hidden comment: RES, 0402, 1M, 1%)
R3  value 309k, 1%  [RESC0402(1005)_N]  (hidden comment: RES, 0402, 309k, 1%)
R8  51  [RES, 0603]
R9  100K  [RES, 0603]
U1  LTC3539  [QFN45P300X200X80-8N]
U3  ADP7104ACPZ-2.5-R7  Supplier Part Number 1: ADP7104ACPZ-2.5-R7CT-ND  [QFN50P300X300X75-8N]
U4  TXB0108  [TSOP65P640X120-20N]

### Ports
EN_V2p5 (in), FPA_MISO (out), FPA_MOSI (out), FPA_SCLK (out), FPA_SEN (out), FPGA_MISO (in), FPGA_MOSI (in), FPGA_SCLK (in), FPGA_SEN (in)

### Nets
GND: C1.1 C3.1 C6.1 C7.1 C8.1 C9.1 LED1.1(C) LED3.1(C) R3.1 U1.2(PGND) U1.3(GND) U1.7(MODE) U1.9(GND) U3.3(GND) U3.6(GND) U3.9(GND) U4.11(GND)
V2p5: C7.2 C9.2 R8.2 R9.2 U3.1(Vout) U3.2(Sense/Adj) U4.19(VccB)
V3p3: C1.2 C8.2 L1.1 U1.4(Vin) U1.5(~{SHDN}) U4.2(VccA) U4.10(OE)
V5p0: C2.2 C3.2 C6.2 R1.2 R2.2 U1.8(Vout) U3.5(EN/UVLO) U3.8(Vin) ; port EN_V2p5
PG_V3p6: R9.1 U3.7(PG)
NetC2_1: C2.1 R2.1 R3.2 U1.6(FB)
NetJ1_2: U4.20(B1) ; port FPA_SCLK
NetJ1_4: U4.18(B2) ; port FPA_SEN
NetJ1_6: U4.17(B3) ; port FPA_MOSI
NetJ1_8: U4.16(B4) ; port FPA_MISO
NetJ4B_10: U4.1(A1) ; port FPGA_SCLK
NetJ4B_12: U4.3(A2) ; port FPGA_SEN
NetJ4B_16: U4.4(A3) ; port FPGA_MOSI
NetJ4B_18: U4.5(A4) ; port FPGA_MISO
NetL1_2: L1.2 U1.1(SW)
NetLED1_2: LED1.2(A) R1.1
NetLED3_2: LED3.2(A) R8.1

Not connected (* = marked no-connect by the designer): U4 6(A5) 7(A6) 8(A7) 9(A8) 12(B8) 13(B7) 14(B6) 15(B5)

### Notes on the sheet
- 20mA
- Title
- Size:
- Date:
- B
- Number:
- Time:
- Revision:
- Sheet
- of
- File:

### Library data of the parts
C1 = CAP, 1206, 2.2uF: Supplier 1: Digi-Key; Supplier Part Number 1: 587-1329-1-ND
R1 = RES_0603_270: Resistor, 0603, 1/10W, 270 ohm; Manufacturer: Panasonic Electronic Components; Manufacturer Part Number: ERJ-3EKF2700V; Description: RES 270 OHM 1/10W 1% 0603 SMD; Tolerance: ±1%; Power (Watts): 0.1W, 1/10W; Temperature Coefficient: ±100ppm/°C; Supplier 1: Digi-Key; RoHS: RoHS Compliant; Category: Resistors; Stock 1: 54092; Pricing 1: 1=0.1, 50=0.0138, 100=0.0105, 250=0.0078, 500=0.00576, 1000=0.00384 (USD); Packaging: Cut Tape (CT); Resistance (Ohms): 270; Composition: Thick Film; Features: -; Package / Case: 0603 (1608 Metric); Supplier Device Package: 0603; Size / Dimension: 0.063" L x 0.031" W (1.60mm x 0.80mm); Height: 0.022" (0.55mm); Number of Terminations: 2; ComponentLink1URL: http://industrial.panasonic.com/www-cgi/jvcr13pz.cgi?E+PZ+3+AOA0002+ERJ3EKF2700V+7+WW; ComponentLink1Description: http://industrial.panasonic.com/www-cgi/jvcr13pz.cgi?E+PZ+3+AOA0002+ERJ3EKF2700V+7+WW; Supplier Part Number 1: P270HCT-ND
R8 = RES_0603_51: Resistor, 0603, 1/10W, 51 ohm; Manufacturer: Panasonic Electronic Components; Manufacturer Part Number: ERJ-3EKF51R0V; Description: RES 51 OHM 1/10W 1% 0603 SMD; Tolerance: ±1%; Power (Watts): 0.1W, 1/10W; Temperature Coefficient: ±100ppm/°C; Supplier 1: Digi-Key; RoHS: RoHS Compliant; Category: Resistors; Stock 1: 80502; Pricing 1: 1=0.1, 50=0.0138, 100=0.0105, 250=0.0078, 500=0.00576, 1000=0.00384 (USD); Packaging: Cut Tape (CT); Resistance (Ohms): 51; Composition: Thick Film; Features: -; Package / Case: 0603 (1608 Metric); Supplier Device Package: 0603; Size / Dimension: 0.063" L x 0.031" W (1.60mm x 0.80mm); Height: 0.022" (0.55mm); Number of Terminations: 2; ComponentLink1URL: http://industrial.panasonic.com/www-cgi/jvcr13pz.cgi?E+PZ+3+AOA0002+ERJ3EKF51R0V+7+WW; ComponentLink1Description: http://industrial.panasonic.com/www-cgi/jvcr13pz.cgi?E+PZ+3+AOA0002+ERJ3EKF51R0V+7+WW; Supplier Part Number 1: P51.0HCT-ND
R9 = RES_0603_100K: Resistor, 0603, 1/10W, 100K ohm; Manufacturer: Panasonic Electronic Components; Manufacturer Part Number: ERJ-3EKF1003V; Description: RES 100K OHM 1/10W 1% 0603 SMD; Tolerance: ±1%; Power (Watts): 0.1W, 1/10W; Temperature Coefficient: ±100ppm/°C; Supplier 1: Digi-Key; RoHS: RoHS Compliant; Category: Resistors; Stock 1: 6711812; Pricing 1: 1=0.1, 50=0.0138, 100=0.0105, 250=0.0078, 500=0.00576, 1000=0.00384 (USD); Packaging: Cut Tape (CT); Resistance (Ohms): 100k; Composition: Thick Film; Features: -; Package / Case: 0603 (1608 Metric); Supplier Device Package: 0603; Size / Dimension: 0.063" L x 0.031" W (1.60mm x 0.80mm); Height: 0.022" (0.55mm); Number of Terminations: 2; ComponentLink1URL: http://industrial.panasonic.com/www-cgi/jvcr13pz.cgi?E+PZ+3+AOA0002+ERJ3EKF1003V+7+WW; ComponentLink1Description: http://industrial.panasonic.com/www-cgi/jvcr13pz.cgi?E+PZ+3+AOA0002+ERJ3EKF1003V+7+WW; Supplier Part Number 1: P100KHCT-ND
U1 = LTC3539: 2A, 1MHz/2MHz Synchronous Step-Up DC/DC Converters; Supplier 1: Digi-Key; Supplier Part Number 1: LTC3539EDCB#TRMPBFTR-ND
U3 = ADP7104ACPZ-2.5-R7: 2.5V Voltage Regulator; Supplier 1: Digi-Key
U4 = TXB0108; 8-bit Bi-Directional Voltage Translator: Supplier 1: Digi-Key; Supplier Part Number 1: 296-21527-2-ND
C2 = CAP, 0402, 33pF: Supplier 1: Digi-Key; Supplier Part Number 1: 587-1205-1-ND
C3 = CAP, 1206, 47uF: Supplier 1: Digi-Key; Supplier Part Number 1: 445-8047-1-ND
C6 C8 C9 = CAP, 0402, 1uF: Supplier 1: Digi-Key; Supplier Part Number 1: 587-3245-1-ND
C7 = CAP, 0805, 10uF: Supplier 1: Digi-Key; Supplier Part Number 1: 587-2985-1-ND
L1 = INDUCTOR, SMD, 2.2uF: Supplier 1: Digi-Key; Supplier Part Number 1: 445-4242-1-ND
LED1 LED3 = LED, GREEN, 0603, LITE-ON: Supplier 1: Digi-Key; Supplier Part Number 1: 160-1446-1-ND
R2 = RES, 0402, 1M, 1%: Supplier 1: Digi-Key; Supplier Part Number 1: P1.00MLCT-ND
R3 = RES, 0402, 309k, 1%: Supplier 1: Digi-Key; Supplier Part Number 1: RHM309KBHCT-ND

## Sheet SENSE AMP - 4 CH.SchDoc
size B; Organization: Altium Limited; Address1: L3, 12a Rodborough Rd; Address2: Frenchs Forest; Address3: NSW; Address4: Australia 2086
Used 2 times, as channels 0, 1. Parts and nets are listed once, with the designators drawn on the sheet.
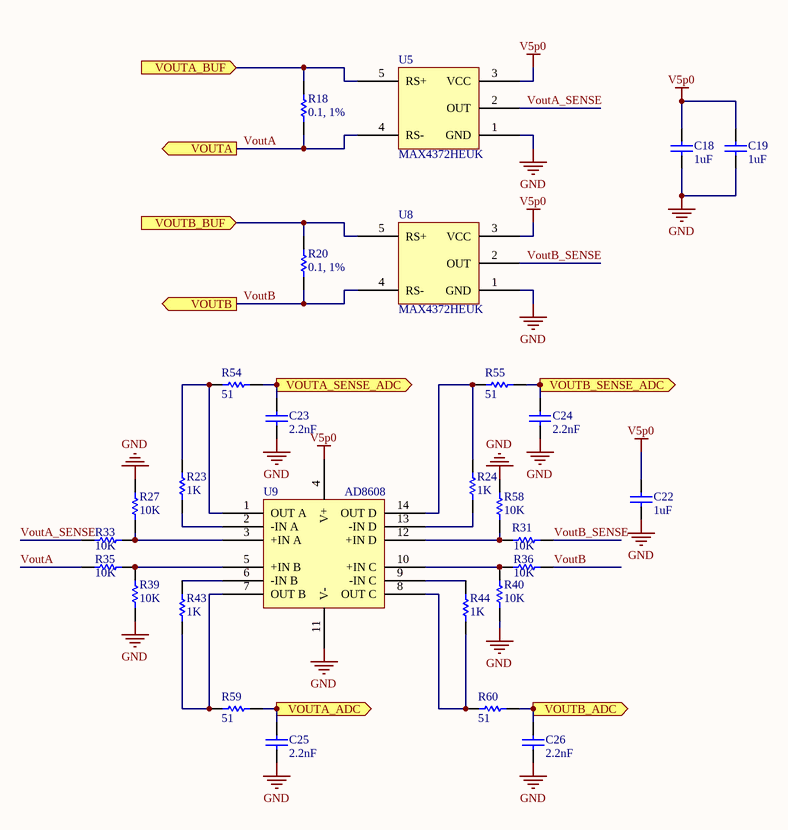
[diagram p4: SENSE AMP - 4 CH.SchDoc]

### Parts
C18  value 1uF  [CAPC01005(0402)22_N]  (hidden comment: CAP, 0402, 1uF)
C19  value 1uF  [CAPC01005(0402)22_N]  (hidden comment: CAP, 0402, 1uF)
C22  value 1uF  [CAPC01005(0402)22_N]  (hidden comment: CAP, 0402, 1uF)
C23  value 2.2nF  [CAPC01005(0402)22_N]  (hidden comment: CAP, 0402, 2.2nF)
C24  value 2.2nF  [CAPC01005(0402)22_N]  (hidden comment: CAP, 0402, 2.2nF)
C25  value 2.2nF  [CAPC01005(0402)22_N]  (hidden comment: CAP, 0402, 2.2nF)
C26  value 2.2nF  [CAPC01005(0402)22_N]  (hidden comment: CAP, 0402, 2.2nF)
R18  value 0.1, 1%  [RES, 0603]  (hidden comment: RES, 0603, 0.1, 1%)
R20  value 0.1, 1%  [RES, 0603]  (hidden comment: RES, 0603, 0.1, 1%)
R23  1K  [RES, 0603]
R24  1K  [RES, 0603]
R27  10K  [RES, 0603]
R31  10K  [RES, 0603]
R33  10K  [RES, 0603]
R35  10K  [RES, 0603]
R36  10K  [RES, 0603]
R39  10K  [RES, 0603]
R40  10K  [RES, 0603]
R43  1K  [RES, 0603]
R44  1K  [RES, 0603]
R54  51  [RES, 0603]
R55  51  [RES, 0603]
R58  10K  [RES, 0603]
R59  51  [RES, 0603]
R60  51  [RES, 0603]
U5  MAX4372HEUK  [SOT23-5, MAX4372H]
U8  MAX4372HEUK  [SOT23-5, MAX4372H]
U9  AD8608  [TSOP65P640X120-14N]

### Ports
VOUTA (out), VOUTA_ADC (out), VOUTA_BUF (in), VOUTA_SENSE_ADC (out), VOUTB (out), VOUTB_ADC (out), VOUTB_BUF (in), VOUTB_SENSE_ADC (out)

### Nets
GND: C18.1 C19.1 C22.1 C23.1 C24.1 C25.1 C26.1 R27.2 R39.1 R40.2 R58.1 U5.1(GND) U8.1(GND) U9.11(V-)
V5p0: C18.2 C19.2 C22.2 U5.3(VCC) U8.3(VCC) U9.4(V+)
VoutA: R18.1 R35.1 U5.4(RS-) ; port VOUTA
VOUTA_ADC: C25.2 R59.2 ; port VOUTA_ADC
VOUTA_BUF: R18.2 U5.5(RS+) ; port VOUTA_BUF
VoutA_SENSE: R33.1 U5.2(OUT)
VOUTA_SENSE_ADC: C23.2 R54.2 ; port VOUTA_SENSE_ADC
VoutB: R20.1 R36.1 U8.4(RS-) ; port VOUTB
VOUTB_ADC: C26.2 R60.2 ; port VOUTB_ADC
VOUTB_BUF: R20.2 U8.5(RS+) ; port VOUTB_BUF
VoutB_SENSE: R31.1 U8.2(OUT)
VOUTB_SENSE_ADC: C24.2 R55.2 ; port VOUTB_SENSE_ADC
NetR23_1: R23.1 U9.2(-IN_A)
NetR23_2: R23.2 R54.1 U9.1(OUT_A)
NetR24_1: R24.1 U9.13(-IN_D)
NetR24_2: R24.2 R55.1 U9.14(OUT_D)
NetR27_1: R27.1 R33.2 U9.3(+IN_A)
NetR31_2: R31.2 R58.2 U9.12(+IN_D)
NetR35_2: R35.2 R39.2 U9.5(+IN_B)
NetR36_2: R36.2 R40.1 U9.10(+IN_C)
NetR43_1: R43.1 R59.1 U9.7(OUT_B)
NetR43_2: R43.2 U9.6(-IN_B)
NetR44_1: R44.1 R60.1 U9.8(OUT_C)
NetR44_2: R44.2 U9.9(-IN_C)

### Channels
0: designators end in _0; ports VOUTA=VoutA VOUTA_ADC=NetC25_0_2 VOUTA_BUF=NetR13_2 VOUTA_SENSE_ADC=NetC23_0_2 VOUTB=VoutB VOUTB_ADC=NetC26_0_2 VOUTB_BUF=NetR20_0_2 VOUTB_SENSE_ADC=NetC24_0_2
1: designators end in _1; ports VOUTA=VoutA VOUTA_ADC=NetC25_1_2 VOUTA_BUF=NetR18_1_2 VOUTA_SENSE_ADC=NetC23_1_2 VOUTB=VoutB VOUTB_ADC=NetC26_1_2 VOUTB_BUF=NetR14_1 VOUTB_SENSE_ADC=NetC24_1_2

### Notes on the sheet
- Title
- Size:
- Date:
- B
- Number:
- Time:
- Revision:
- Sheet
- of
- File:

### Library data of the parts
C23-C26 = CAP, 0402, 2.2nF: Manufacturer: Taiyo Yuden; Manufacturer Part Number: UMK105B7222KV-F; Capacitance: 2200pF; Voltage - Rated: 50V; Tolerance: ±10%; Temperature Coefficient: X7R; Description: CAP CER 2200PF 50V 10% X7R 0402; Packaging: Cut Tape (CT); Mounting Type: Surface Mount, MLCC; Operating Temperature: -55°C ~ 125°C; Applications: General Purpose; Ratings: -; Package / Case: 0402 (1005 Metric); Size / Dimension: 0.039" L x 0.020" W (1.00mm x 0.50mm); Height - Seated (Max): -; Thickness (Max): 0.022" (0.55mm); Lead Spacing: -; Features: -; Lead Style: -; ComponentLink1URL: http://www.yuden.co.jp/or/product/category/capacitor/UMK105B7222KV-F.pdf; ComponentLink1Description: http://www.yuden.co.jp/or/product/category/capacitor/UMK105B7222KV-F.pdf; Supplier 1: Digi-Key; Supplier Part Number 1: 587-1221-1-ND; RoHS: RoHS Compliant; Category: Capacitors; Stock 1: 180048; Pricing 1: 1=0.1, 10=0.014, 50=0.0078, 100=0.0066, 250=0.0054, 500=0.00462, 1000=0.0036, 5000=0.003 (USD)
R18 R20 = RES, 0603, 0.1, 1%: Manufacturer: Panasonic Electronic Components; Manufacturer Part Number: ERJ-3RSFR10V; Resistance (Ohms): 0.1; Power (Watts): 0.1W, 1/10W; Temperature Coefficient: ±300ppm/°C; Description: RES 0.1 OHM 1/10W 1% 0603 SMD; Packaging: Cut Tape (CT); Tolerance: ±1%; Composition: Thick Film; Features: -; Package / Case: 0603 (1608 Metric); Supplier Device Package: 0603; Size / Dimension: 0.063" L x 0.031" W (1.60mm x 0.80mm); Height: 0.022" (0.55mm); Number of Terminations: 2; ComponentLink1URL: http://industrial.panasonic.com/www-cgi/jvcr13pz.cgi?E+PZ+3+AOA0003+ERJ3RSFR10V+7+WW; ComponentLink1Description: http://industrial.panasonic.com/www-cgi/jvcr13pz.cgi?E+PZ+3+AOA0003+ERJ3RSFR10V+7+WW; Supplier 1: Digi-Key; Supplier Part Number 1: P.10AJCT-ND; RoHS: RoHS Compliant; Category: Resistors; Stock 1: 81086; Pricing 1: 1=0.48, 50=0.1898, 100=0.1465, 250=0.11392, 500=0.0803, 1000=0.05859 (USD)
R23 R24 R43 R44 = RES_0603_1K: as R13 on sheet BIAS; Supplier 1: Digi-Key; RoHS: RoHS Compliant; Category: Resistors; Stock 1: 3447685; Pricing 1: 1=0.1, 50=0.0138, 100=0.0105, 250=0.0078, 500=0.00576, 1000=0.00384 (USD); Packaging: Cut Tape (CT); Resistance (Ohms): 1k; Composition: Thick Film; Features: -; Package / Case: 0603 (1608 Metric); Supplier Device Package: 0603; Size / Dimension: 0.063" L x 0.031" W (1.60mm x 0.80mm); Height: 0.022" (0.55mm); Number of Terminations: 2; ComponentLink1URL: http://industrial.panasonic.com/www-cgi/jvcr13pz.cgi?E+PZ+3+AOA0002+ERJ3EKF1001V+7+WW; ComponentLink1Description: http://industrial.panasonic.com/www-cgi/jvcr13pz.cgi?E+PZ+3+AOA0002+ERJ3EKF1001V+7+WW; Supplier Part Number 1: P1.00KHCT-ND
R27 R31 R33 R35 R36 R39 R40 R58 = RES_0603_10K: as R10 on sheet HEADERS; Supplier 1: Digi-Key; RoHS: RoHS Compliant; Category: Resistors; Stock 1: 4631019; Pricing 1: 1=0.1, 50=0.0138, 100=0.0105, 250=0.0078, 500=0.00576, 1000=0.00384 (USD); Packaging: Cut Tape (CT); Resistance (Ohms): 10k; Composition: Thick Film; Features: -; Package / Case: 0603 (1608 Metric); Supplier Device Package: 0603; Size / Dimension: 0.063" L x 0.031" W (1.60mm x 0.80mm); Height: 0.022" (0.55mm); Number of Terminations: 2; ComponentLink1URL: http://industrial.panasonic.com/www-cgi/jvcr13pz.cgi?E+PZ+3+AOA0002+ERJ3EKF1002V+7+WW; ComponentLink1Description: http://industrial.panasonic.com/www-cgi/jvcr13pz.cgi?E+PZ+3+AOA0002+ERJ3EKF1002V+7+WW; Supplier Part Number 1: P10.0KHCT-ND
R54 R55 R59 R60 = RES_0603_51: as R8 on sheet POWER; Supplier 1: Digi-Key; RoHS: RoHS Compliant; Category: Resistors; Stock 1: 80502; Pricing 1: 1=0.1, 50=0.0138, 100=0.0105, 250=0.0078, 500=0.00576, 1000=0.00384 (USD); Packaging: Cut Tape (CT); Resistance (Ohms): 51; Composition: Thick Film; Features: -; Package / Case: 0603 (1608 Metric); Supplier Device Package: 0603; Size / Dimension: 0.063" L x 0.031" W (1.60mm x 0.80mm); Height: 0.022" (0.55mm); Number of Terminations: 2; ComponentLink1URL: http://industrial.panasonic.com/www-cgi/jvcr13pz.cgi?E+PZ+3+AOA0002+ERJ3EKF51R0V+7+WW; ComponentLink1Description: http://industrial.panasonic.com/www-cgi/jvcr13pz.cgi?E+PZ+3+AOA0002+ERJ3EKF51R0V+7+WW; Supplier Part Number 1: P51.0HCT-ND
U5 U8 = MAX4372H, Current-Sense, SOT23: Manufacturer: Maxim; Manufacturer PN: MAX4372HEUK+T; Supplier: Digikey; Supplier PN: MAX4372HEUK_TCT-ND; Supplier link: http://www.digikey.com/product-detail/en/MAX4372HEUK%2BT/MAX4372HEUK%2BTCT-ND/2234345; Unit price: 1.97
U9 = AD8608: Quad Op-Amp; Manufacturer: Analog Devices Inc; Manufacturer Part Number: AD8608ARZ-REEL; Amplifier Type: General Purpose; Number of Circuits: 4; Output Type: Rail-to-Rail; Slew Rate: 5 V/µs; Gain Bandwidth Product: 10MHz; Current - Input Bias: 0.2pA; Voltage - Input Offset: 80µV; Current - Supply: 1mA; Current - Output / Channel: 80mA; Voltage - Supply, Single/Dual (±): 2.7 V ~ 5.5 V; Description: IC OPAMP GP 10MHZ RRO 14SOIC; Packaging: Cut Tape (CT); -3db Bandwidth: -; Operating Temperature: -40°C ~ 125°C; Mounting Type: Surface Mount; Package / Case: 14-SOIC (0.154", 3.90mm Width); Supplier Device Package: 14-SOIC; ComponentLink1URL: http://www.analog.com/static/imported-files/data_sheets/AD8605_8606_8608.pdf; ComponentLink1Description: http://www.analog.com/static/imported-files/data_sheets/AD8605_8606_8608.pdf; Supplier 1: Digi-Key; Supplier Part Number 1: AD8608ARZ-REELCT-ND; RoHS: RoHS Compliant; Stock 1: 2419; Pricing 1: 1=4.22, 10=3.785, 25=3.4036, 100=3.0954, 250=2.80196, 500=2.50858, 1000=2.11248 (USD); Category: Integrated Circuits (ICs)
C18 C19 C22 = CAP, 0402, 1uF: Supplier 1: Digi-Key; Supplier Part Number 1: 587-3245-1-ND

## Sheet SENSE ADC - 8CH.SchDoc
size B; Organization: Altium Limited; Address1: L3, 12a Rodborough Rd; Address2: Frenchs Forest; Address3: NSW; Address4: Australia 2086
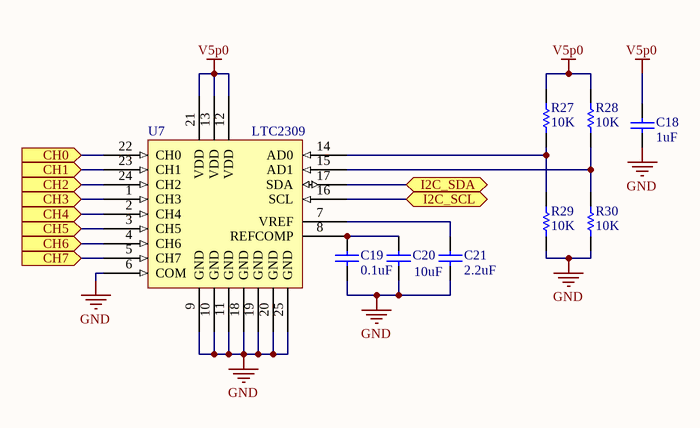
[diagram p5: SENSE ADC - 8CH.SchDoc]

### Parts
C18  value 1uF  [CAPC01005(0402)22_N]  (hidden comment: CAP, 0402, 1uF)
C19  value 0.1uF  [CAPC01005(0402)22_N]  (hidden comment: CAP, 0402, 0.1uF)
C20  value 10uF  [CAPC0805(2012)130_N]  (hidden comment: CAP, 0805, 10uF)
C21  value 2.2uF  [CAPC01005(0402)22_N]  (hidden comment: CAP, 0402, 2.2uF)
R27  10K  [RES, 0603]
R28  10K  [RES, 0603]
R29  10K  [RES, 0603]
R30  10K  [RES, 0603]
U7  LTC2309  [QFN50P400X400X80-24N]

### Ports
CH0 (in), CH1 (in), CH2 (in), CH3 (in), CH4 (in), CH5 (in), CH6 (in), CH7 (in), I2C_SCL (bidir), I2C_SDA (bidir)

### Nets
GND: C18.1 C19.1 C20.1 C21.1 R29.2 R30.2 U7.6(COM) U7.9(GND) U7.10(GND) U7.11(GND) U7.18(GND) U7.19(GND) U7.20(GND) U7.25(GND)
V5p0: C18.2 R27.1 R28.1 U7.12(VDD) U7.13(VDD) U7.21(VDD)
NetC19_2: C19.2 C20.2 U7.8(REFCOMP)
NetC21_2: C21.2 U7.7(VREF)
NetC23_0_2: U7.22(CH0) ; port CH0
NetC23_1_2: U7.2(CH4) ; port CH4
NetC24_0_2: U7.23(CH1) ; port CH1
NetC24_1_2: U7.3(CH5) ; port CH5
NetC25_0_2: U7.24(CH2) ; port CH2
NetC25_1_2: U7.4(CH6) ; port CH6
NetC26_0_2: U7.1(CH3) ; port CH3
NetC26_1_2: U7.5(CH7) ; port CH7
NetJ4B_6: U7.16(SCL) ; port I2C_SCL
NetJ4B_8: U7.17(SDA) ; port I2C_SDA
NetR27_2: R27.2 R29.1 U7.14(AD0)
NetR28_2: R28.2 R30.1 U7.15(AD1)

### Notes on the sheet
- Title
- Size:
- Date:
- B
- Number:
- Time:
- Revision:
- Sheet
- of
- File:

### Library data of the parts
C21 = CAP, 0402, 2.2uF: Manufacturer: Taiyo Yuden; Manufacturer Part Number: EMK105ABJ225MV-F; Capacitance: 2.2µF; Voltage - Rated: 16V; Tolerance: ±20%; Temperature Coefficient: X5R; Description: CAP CER 2.2UF 16V 20% X5R 0402; Supplier 1: Digi-Key; Supplier Part Number 1: 587-3245-1-ND; Packaging: Cut Tape (CT); Mounting Type: Surface Mount, MLCC; Operating Temperature: -55°C ~ 85°C; Applications: General Purpose; Ratings: -; Package / Case: 0402 (1005 Metric); Size / Dimension: 0.039" L x 0.020" W (1.00mm x 0.50mm); Height - Seated (Max): -; Thickness (Max): 0.022" (0.55mm); Lead Spacing: -; Features: -; Lead Style: -; ComponentLink1URL: http://www.yuden.co.jp/productdata/catalog/en/mlcc101_e.pdf; ComponentLink1Description: http://www.yuden.co.jp/productdata/catalog/en/mlcc101_e.pdf; Supplier 2: Digi-Key; Supplier Part Number 2: 587-3302-1-ND; RoHS: RoHS Compliant; Category: Capacitors; Stock 2: 46990; Pricing 2: 1=0.49, 10=0.371, 50=0.2162, 100=0.1729, 250=0.12352, 500=0.08398, 1000=0.06793, 5000=0.05311 (USD)
R27-R30 = RES_0603_10K: as R10 on sheet HEADERS; Supplier 1: Digi-Key; RoHS: RoHS Compliant; Category: Resistors; Stock 1: 4631019; Pricing 1: 1=0.1, 50=0.0138, 100=0.0105, 250=0.0078, 500=0.00576, 1000=0.00384 (USD); Packaging: Cut Tape (CT); Resistance (Ohms): 10k; Composition: Thick Film; Features: -; Package / Case: 0603 (1608 Metric); Supplier Device Package: 0603; Size / Dimension: 0.063" L x 0.031" W (1.60mm x 0.80mm); Height: 0.022" (0.55mm); Number of Terminations: 2; ComponentLink1URL: http://industrial.panasonic.com/www-cgi/jvcr13pz.cgi?E+PZ+3+AOA0002+ERJ3EKF1002V+7+WW; ComponentLink1Description: http://industrial.panasonic.com/www-cgi/jvcr13pz.cgi?E+PZ+3+AOA0002+ERJ3EKF1002V+7+WW; Supplier Part Number 1: P10.0KHCT-ND
U7 = LTC2309: 8-Channel, 12-Bit SAR ADC with I2C Interface; Manufacturer: Linear Technology; Manufacturer Part Number: LTC2309CUF#PBF; Number of Bits: 12; Sampling Rate (Per Second): 14k; Data Interface: I²C, Serial; Number of Converters: 1; Voltage Supply Source: Single Supply; Number of Inputs and Type: 8 Single-Ended, Unipolar; 8 Single-Ended, Bipolar; 4 Differential, Unipolar; 4 Differential, Bipolar; Description: IC ADC 12BIT SAR 24-QFN; Packaging: Tube; Operating Temperature: 0°C ~ 70°C; Mounting Type: Surface Mount; Package / Case: 24-WFQFN Exposed Pad; Supplier Device Package: 24-QFN Exposed Pad (4x4); ComponentLink1URL: http://www.linear.com/docs/25786; ComponentLink1Description: http://www.linear.com/docs/25786; Supplier 1: Digi-Key; Supplier Part Number 1: LTC2309CUF#PBF-ND; RoHS: RoHS Compliant; Category: Integrated Circuits (ICs); Stock 1: 532; Pricing 1: 1=6.31, 25=5.27, 100=4.34 (USD)
C18 = CAP, 0402, 1uF: Supplier 1: Digi-Key; Supplier Part Number 1: 587-3245-1-ND
C19 = CAP, 0402, 0.1uF: Supplier 1: Digi-Key; Supplier Part Number 1: 587-1456-2-ND
C20 = CAP, 0805, 10uF: Supplier 1: Digi-Key; Supplier Part Number 1: 587-2985-1-ND

## Sheet OUTPUT HEADERS.SchDoc
size B; Organization: Altium Limited; Address1: L3, 12a Rodborough Rd; Address2: Frenchs Forest; Address3: NSW; Address4: Australia 2086
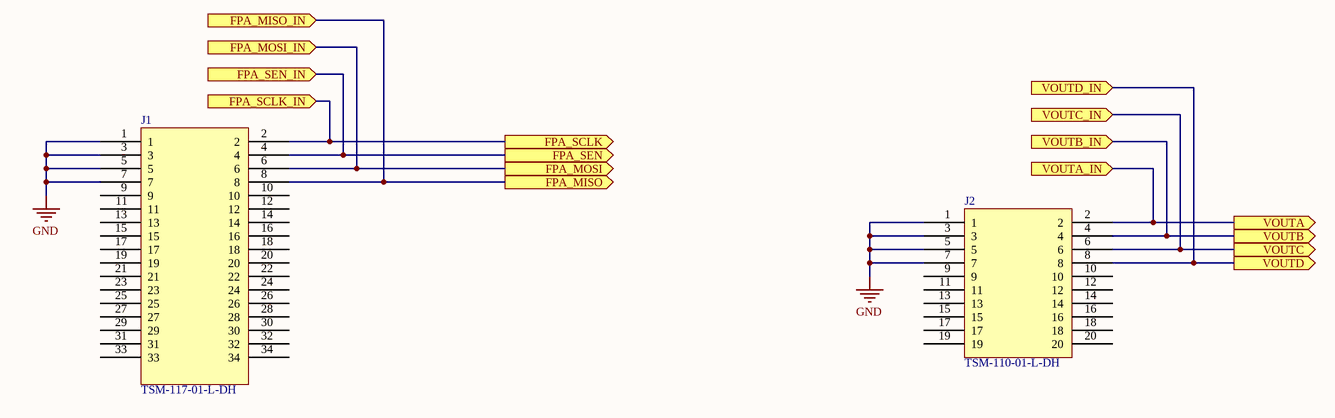
[diagram p6: OUTPUT HEADERS.SchDoc]

### Parts
J1  TSM-117-01-L-DH  [HEADER_25.4MM_17x2_SMT_RA_TOP]
J2  TSM-110-01-L-DH  [HEADER_25.4MM_10x2_SMT_RA_TOP]

### Ports
FPA_MISO (out), FPA_MISO_IN (in), FPA_MOSI (out), FPA_MOSI_IN (in), FPA_SCLK (out), FPA_SCLK_IN (in), FPA_SEN (out), FPA_SEN_IN (in), VOUTA (out), VOUTA_IN (in), VOUTB (out), VOUTB_IN (in), VOUTC (out), VOUTC_IN (in), VOUTD (out), VOUTD_IN (in)

### Nets
GND: J1.1 J1.3 J1.5 J1.7 J2.1 J2.3 J2.5 J2.7
VoutA: J2.2 ; port VOUTA, port VOUTA_IN
VoutA: J2.6 ; port VOUTC, port VOUTC_IN  [a separate net that carries the same name]
VoutB: J2.4 ; port VOUTB, port VOUTB_IN
VoutB: J2.8 ; port VOUTD, port VOUTD_IN  [a separate net that carries the same name]
NetJ1_2: J1.2 ; port FPA_SCLK, port FPA_SCLK_IN
NetJ1_4: J1.4 ; port FPA_SEN, port FPA_SEN_IN
NetJ1_6: J1.6 ; port FPA_MOSI, port FPA_MOSI_IN
NetJ1_8: J1.8 ; port FPA_MISO, port FPA_MISO_IN

Not connected (* = marked no-connect by the designer): J1 9 10 11 12 13 14 15 16 17 18 19 20 21 22 23 24 25 26 27 28 29 30 31 32 33 34; J2 9 10 11 12 13 14 15 16 17 18 19 20

### Notes on the sheet
- Title
- Size:
- Date:
- B
- Number:
- Time:
- Revision:
- Sheet
- of
- File:

### Library data of the parts
J1 = TSM-117-01-L-DH: Manufacturer: Samtec Inc; Connector Type: Header, Unshrouded; Number of Positions: 34; Number of Positions Loaded: All; Pitch: 0.100" (2.54mm); Description: CONN HEADER 34POS .100" DBL SMD; Packaging: Tube; Contact Type: Male Pin; Number of Rows: 2; Row Spacing: 0.100" (2.54mm); Contact Mating Length: 0.230" (5.84mm); Mounting Type: Surface Mount, Right Angle; Termination: Solder; Fastening Type: -; Features: -; Contact Finish: Gold; Contact Finish Thickness: 10µin (0.25µm); Color: Black; ComponentLink1URL: http://www.samtec.com/documents/webfiles/cpdf/TSM-1XX-XX-XXX-XX-XX-XXX-XX-MKT1.pdf; ComponentLink1Description: http://www.samtec.com/documents/webfiles/cpdf/TSM-1XX-XX-XXX-XX-XX-XXX-XX-MKT1.pdf; Supplier 1: Digi-Key; Supplier Part Number 1: TSM-117-01-L-DH-ND; Manufacturer Part Number: TSM-117-01-L-DH; RoHS: RoHS Compliant; Category: Connectors, Interconnects; Stock 1: 0; Pricing 1: 1=4.47 (USD)
J2 = TSM-110-01-L-DH: Manufacturer: Samtec Inc; Connector Type: Header, Unshrouded; Number of Positions: 20; Number of Positions Loaded: All; Pitch: 0.100" (2.54mm); Description: CONN HEADER 20POS .100" DBL SMD; Packaging: Tube; Contact Type: Male Pin; Number of Rows: 2; Row Spacing: 0.100" (2.54mm); Contact Mating Length: 0.230" (5.84mm); Mounting Type: Surface Mount, Right Angle; Termination: Solder; Fastening Type: -; Features: -; Contact Finish: Gold; Contact Finish Thickness: 10µin (0.25µm); Color: Black; ComponentLink1URL: http://www.samtec.com/documents/webfiles/cpdf/TSM-1XX-XX-XXX-XX-XX-XXX-XX-MKT1.pdf; ComponentLink1Description: http://www.samtec.com/documents/webfiles/cpdf/TSM-1XX-XX-XXX-XX-XX-XXX-XX-MKT1.pdf; Supplier 1: Digi-Key; Supplier Part Number 1: TSM-110-01-L-DH-ND; Manufacturer Part Number: TSM-110-01-L-DH; RoHS: RoHS Compliant; Category: Connectors, Interconnects; Stock 1: 0; Pricing 1: 1=2.63 (USD)

## Nets that join several sheets
GND: HEADERS (80 pins), BIAS (16 pins), POWER (17 pins), 0 (14 pins), 1 (14 pins), SENSE ADC - 8CH (14 pins), OUTPUT HEADERS (8 pins)
V3p3: HEADERS (J4B.1 J4B.3 J4T.1 J4T.3), POWER (7 pins)
V5p0: HEADERS (R10.1 R11.1), BIAS (8 pins), POWER (8 pins), 0 (6 pins), 1 (6 pins), SENSE ADC - 8CH (6 pins)
NetC23_0_2: 0 (C23_0.2 R54_0.2), SENSE ADC - 8CH (U7.22)
NetC23_1_2: 1 (C23_1.2 R54_1.2), SENSE ADC - 8CH (U7.2)
NetC24_0_2: 0 (C24_0.2 R55_0.2), SENSE ADC - 8CH (U7.23)
NetC24_1_2: 1 (C24_1.2 R55_1.2), SENSE ADC - 8CH (U7.3)
NetC25_0_2: 0 (C25_0.2 R59_0.2), SENSE ADC - 8CH (U7.24)
NetC25_1_2: 1 (C25_1.2 R59_1.2), SENSE ADC - 8CH (U7.4)
NetC26_0_2: 0 (C26_0.2 R60_0.2), SENSE ADC - 8CH (U7.1)
NetC26_1_2: 1 (C26_1.2 R60_1.2), SENSE ADC - 8CH (U7.5)
NetJ1_2: POWER (U4.20), OUTPUT HEADERS (J1.2)
NetJ1_4: POWER (U4.18), OUTPUT HEADERS (J1.4)
NetJ1_6: POWER (U4.17), OUTPUT HEADERS (J1.6)
NetJ1_8: POWER (U4.16), OUTPUT HEADERS (J1.8)
NetJ4B_6: HEADERS (J4B.6 J4T.6 R10.2), BIAS (U5.7), SENSE ADC - 8CH (U7.16)
NetJ4B_8: HEADERS (J4B.8 J4T.8 R11.2), BIAS (U5.9), SENSE ADC - 8CH (U7.17)
NetJ4B_10: HEADERS (J4B.10 J4T.10), POWER (U4.1)
NetJ4B_12: HEADERS (J4B.12 J4T.12), POWER (U4.3)
NetJ4B_16: HEADERS (J4B.16 J4T.16), POWER (U4.4)
NetJ4B_18: HEADERS (J4B.18 J4T.18), POWER (U4.5)
NetR13_2: BIAS (R13.2 U6.1), 0 (R18_0.2 U5_0.5)
NetR14_1: BIAS (R14.1 U6.14), 1 (R20_1.2 U8_1.5)
NetR18_1_2: BIAS (R23.2 U6.8), 1 (R18_1.2 U5_1.5)
NetR20_0_2: BIAS (R22.1 U6.7), 0 (R20_0.2 U8_0.5)
VoutA: 0 (R18_0.1 R35_0.1 U5_0.4), OUTPUT HEADERS (J2.2)
VoutA: 1 (R18_1.1 R35_1.1 U5_1.4), OUTPUT HEADERS (J2.6)
VoutB: 0 (R20_0.1 R36_0.1 U8_0.4), OUTPUT HEADERS (J2.4)
VoutB: 1 (R20_1.1 R36_1.1 U8_1.4), OUTPUT HEADERS (J2.8)